# EasyEDA schematic PI_SCH_FPC.json
TITLE: DRONE_PI_SHIELD_FPC; REV: 2.0; Date: 17-11-2023; Sheet: 1/1; Company: QUB
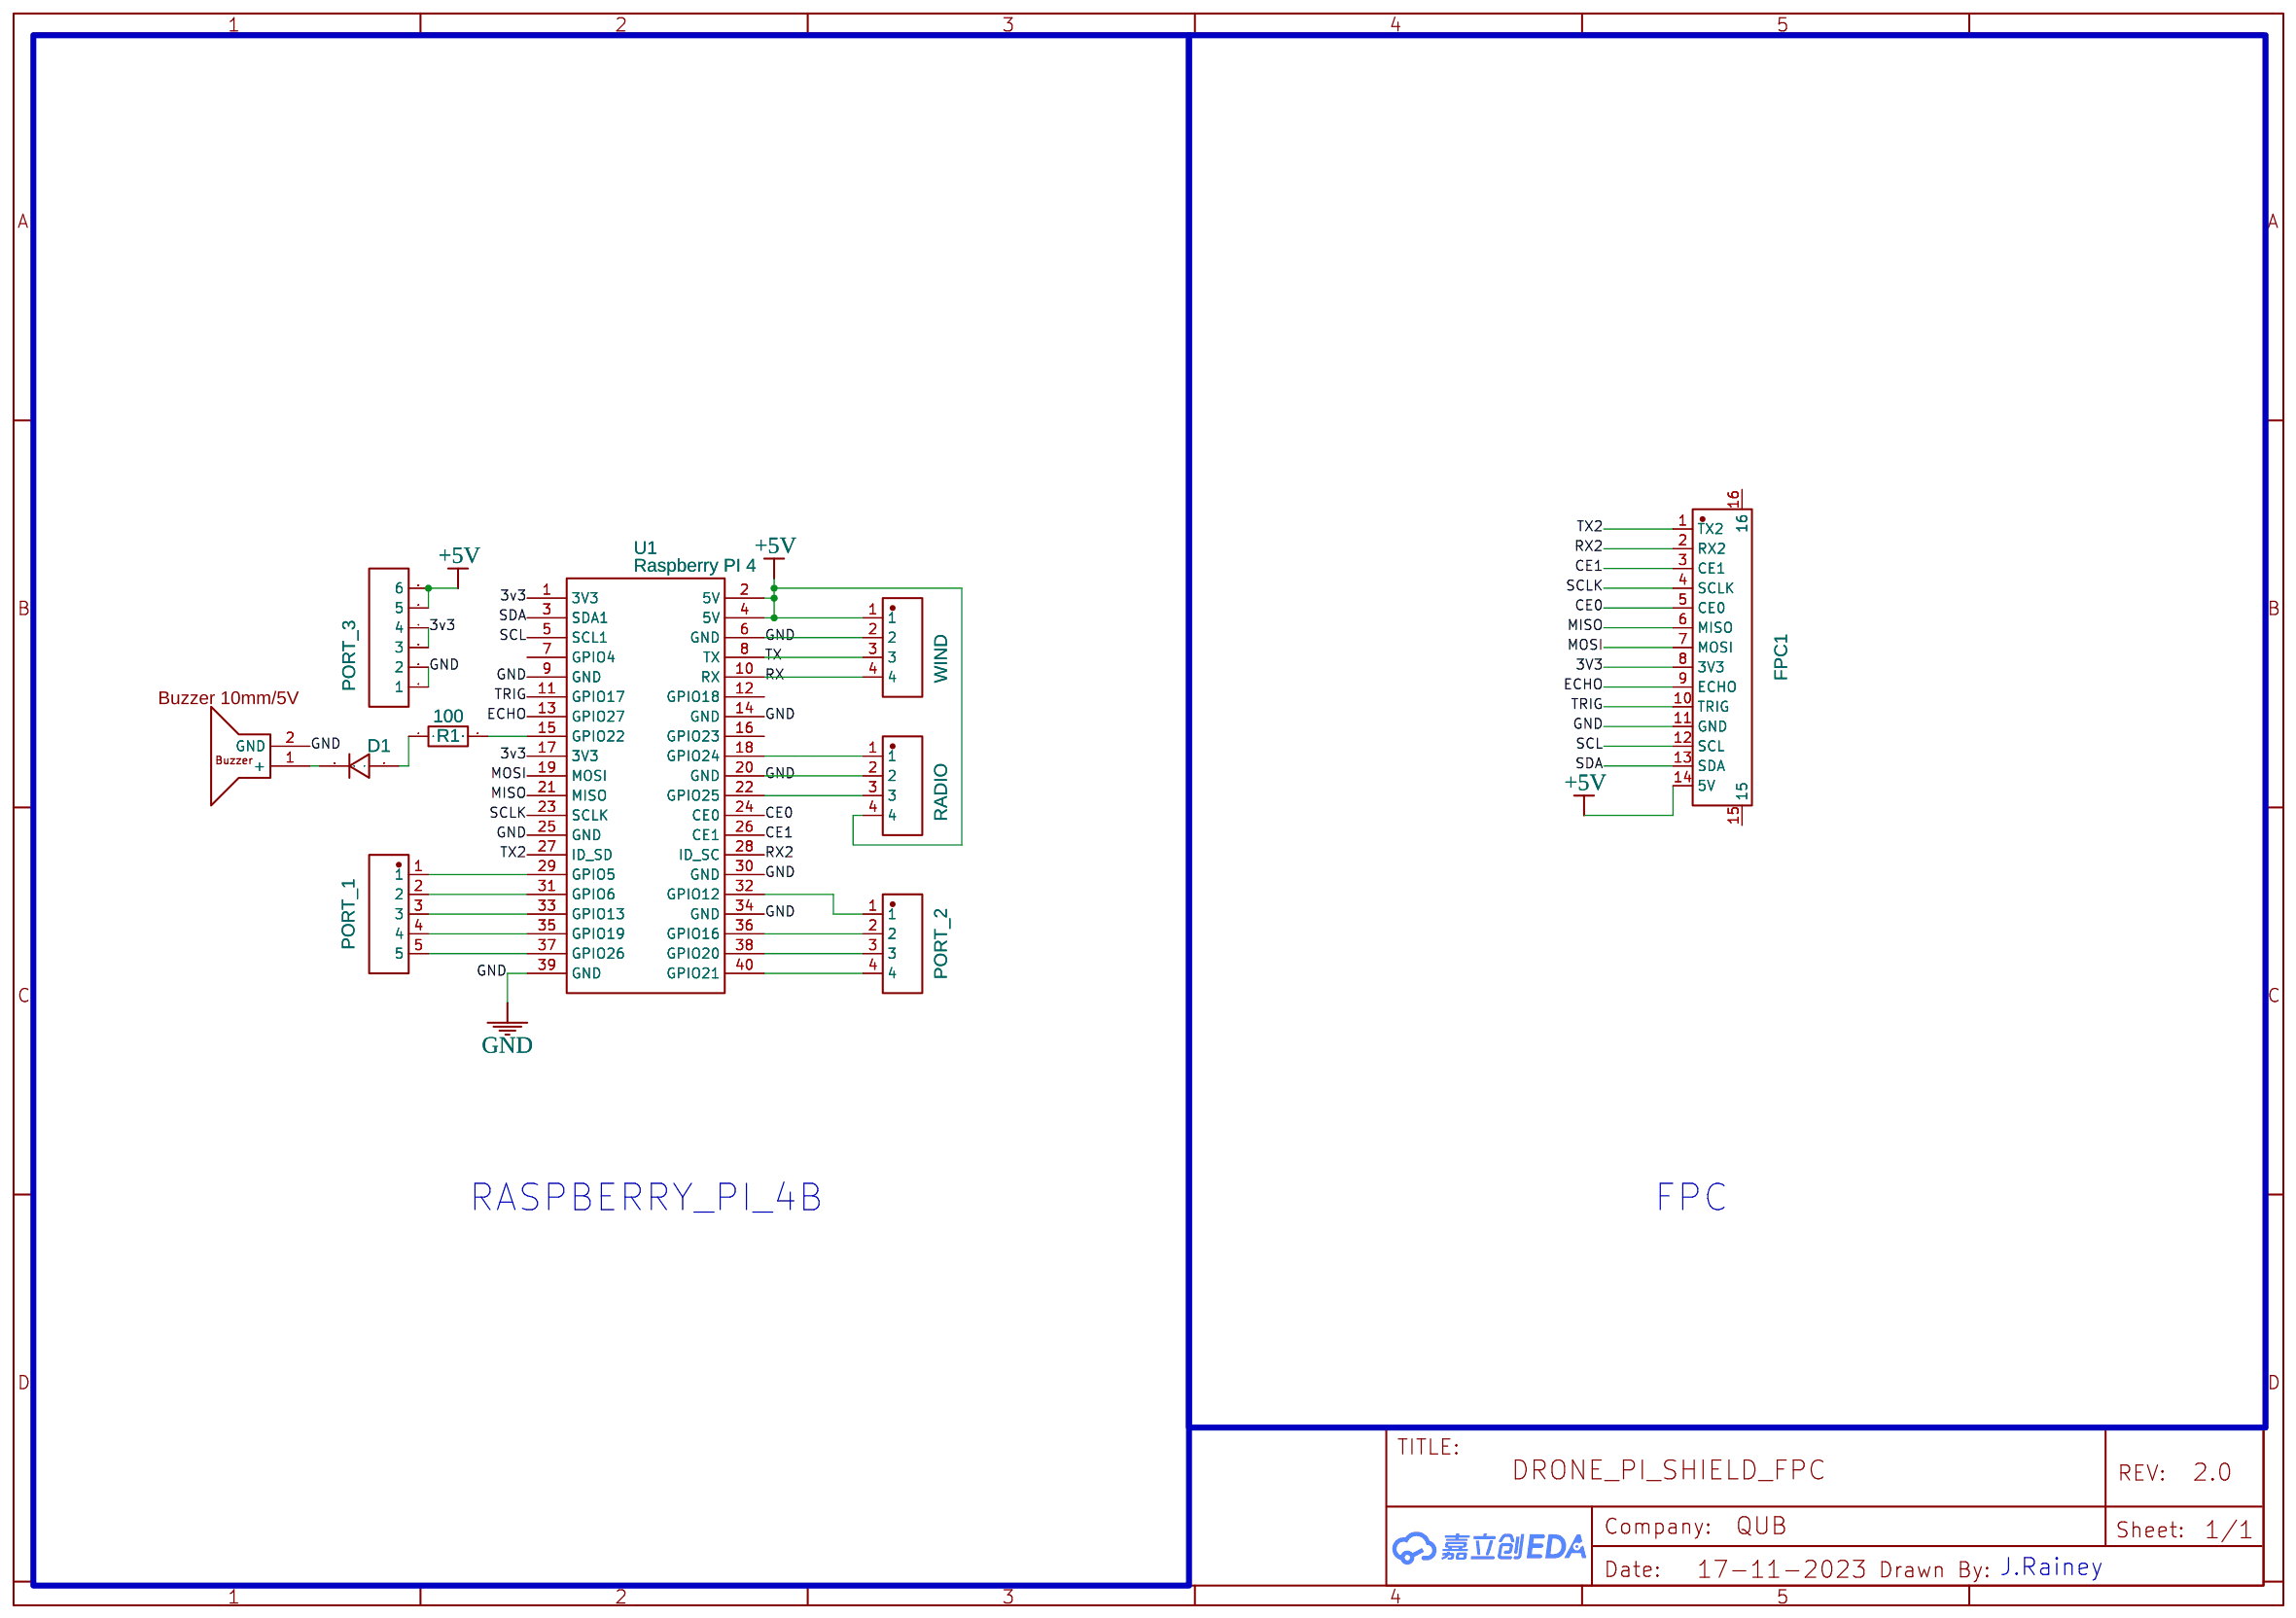
[diagram p0: schematic sheet]

## Parts
BUZZER1  Buzzer 10mm/5V  [BUZZER 10MM [PCB]]
D1  1N4448  [DO-35_BD2.0-L4.2-P8.20-D0.5-R-RD]
FPC1  1.0K-FX-14PWB  [CONN-SMD_14P-P1.00_HDGC_1.0K-FX-14PWB]
PORT_1  PZ254V-11-05P  [HDR-TH_5P-P2.54-V-M]
PORT_2  PZ254V-11-04P  [HDR-TH_4P-P2.54-V-M]
PORT_3  HEADER-MALE-2.54_1X6  [HDR-TH_6P-P2.54-V]
R1  100  [R_AXIAL-0.4]
RADIO  PZ254V-11-04P  [HDR-TH_4P-P2.54-V-M]
U1  Raspberry PI 4  [RASPBERRY PI 4]
WIND  PZ254V-11-04P  [HDR-TH_4P-P2.54-V-M]

## Library data of the parts
BUZZER1 = Buzzer 10mm/5V: Supplier: SHIVRAM; Supplier Part: BUZZER; Manufacturer: SHIVRAM; Manufacturer Part: BUZZER; Contributor: Scikraft; Package Display: No
D1 = 1N4448: Contributor: 官方封装库; Supplier: LCSC; Manufacturer: ST(先科); Supplier Part: C54037; JLCPCB Part Class: Extended Part
FPC1 = 1.0K-FX-14PWB: Contributor: LCSC; Supplier: LCSC; Supplier Part: C2914073; Manufacturer: HDGC(华德共创); JLCPCB Part Class: Extended Part
PORT_1 = PZ254V-11-05P: Supplier: LCSC; Supplier Part: C492404; Manufacturer: XFCN; Contributor: muratsozen; JLCPCB Part Class: Extended Part
PORT_2 RADIO WIND = PZ254V-11-04P: Supplier: LCSC; Supplier Part: C492403; Manufacturer: XFCN; Contributor: vatsal patel; JLCPCB Part Class: Extended Part
PORT_3 = HEADER-MALE-2.54_1X6: Supplier: LCSC; Manufacturer: BOOMELE; Manufacturer Part: Header-Male-2.54_1x6; Supplier Part: C37208
R1 = R_AXIAL-0.4_EU: Contributor: LCEDA_Lib
U1 = Raspberry PI 4: Contributor: RachelTX; subpart_no: 2

## Nets
3v3: PORT_3.3 PORT_3.4 U1.1(3V3) U1.17(3V3)
3V3: FPC1.8(3V3)
+5V: FPC1.14(5V) PORT_3.5 PORT_3.6 RADIO.4 U1.2(5V) U1.4(5V) WIND.1
GND: BUZZER1.2(GND) FPC1.11(GND) PORT_3.1 PORT_3.2 RADIO.2 U1.6(GND) U1.9(GND) U1.14(GND) U1.20(GND) U1.25(GND) U1.30(GND) U1.34(GND) U1.39(GND) WIND.2
CE0: FPC1.5(CE0) U1.24(CE0)
CE1: FPC1.3(CE1) U1.26(CE1)
ECHO: FPC1.9(ECHO) U1.13(GPIO27)
MISO: FPC1.6(MISO) U1.21(MISO)
MOSI: FPC1.7(MOSI) U1.19(MOSI)
RX: U1.10(RX) WIND.4
RX2: FPC1.2(RX2) U1.28(ID_SC)
SCL: FPC1.12(SCL) U1.5(SCL1)
SCLK: FPC1.4(SCLK) U1.23(SCLK)
SDA: FPC1.13(SDA) U1.3(SDA1)
TRIG: FPC1.10(TRIG) U1.11(GPIO17)
TX: U1.8(TX) WIND.3
TX2: FPC1.1(TX2) U1.27(ID_SD)
Net-(BUZZER1-1): BUZZER1.1(+) D1.2(K)
Net-(D1-1): D1.1(A) R1.1
Net-(PORT_1-1): PORT_1.1 U1.29(GPIO5)
Net-(PORT_1-2): PORT_1.2 U1.31(GPIO6)
Net-(PORT_1-3): PORT_1.3 U1.33(GPIO13)
Net-(PORT_1-4): PORT_1.4 U1.35(GPIO19)
Net-(PORT_1-5): PORT_1.5 U1.37(GPIO26)
Net-(PORT_2-1): PORT_2.1 U1.32(GPIO12)
Net-(PORT_2-2): PORT_2.2 U1.36(GPIO16)
Net-(PORT_2-3): PORT_2.3 U1.38(GPIO20)
Net-(PORT_2-4): PORT_2.4 U1.40(GPIO21)
Net-(R1-2): R1.2 U1.15(GPIO22)
Net-(RADIO-1): RADIO.1 U1.18(GPIO24)
Net-(RADIO-3): RADIO.3 U1.22(GPIO25)

Not connected (* = marked no-connect by the designer): FPC1 15 16; U1 7(GPIO4) 12(GPIO18) 16(GPIO23)

## Notes on the sheet
- RASPBERRY_PI_4B
- FPC
- J.Rainey
